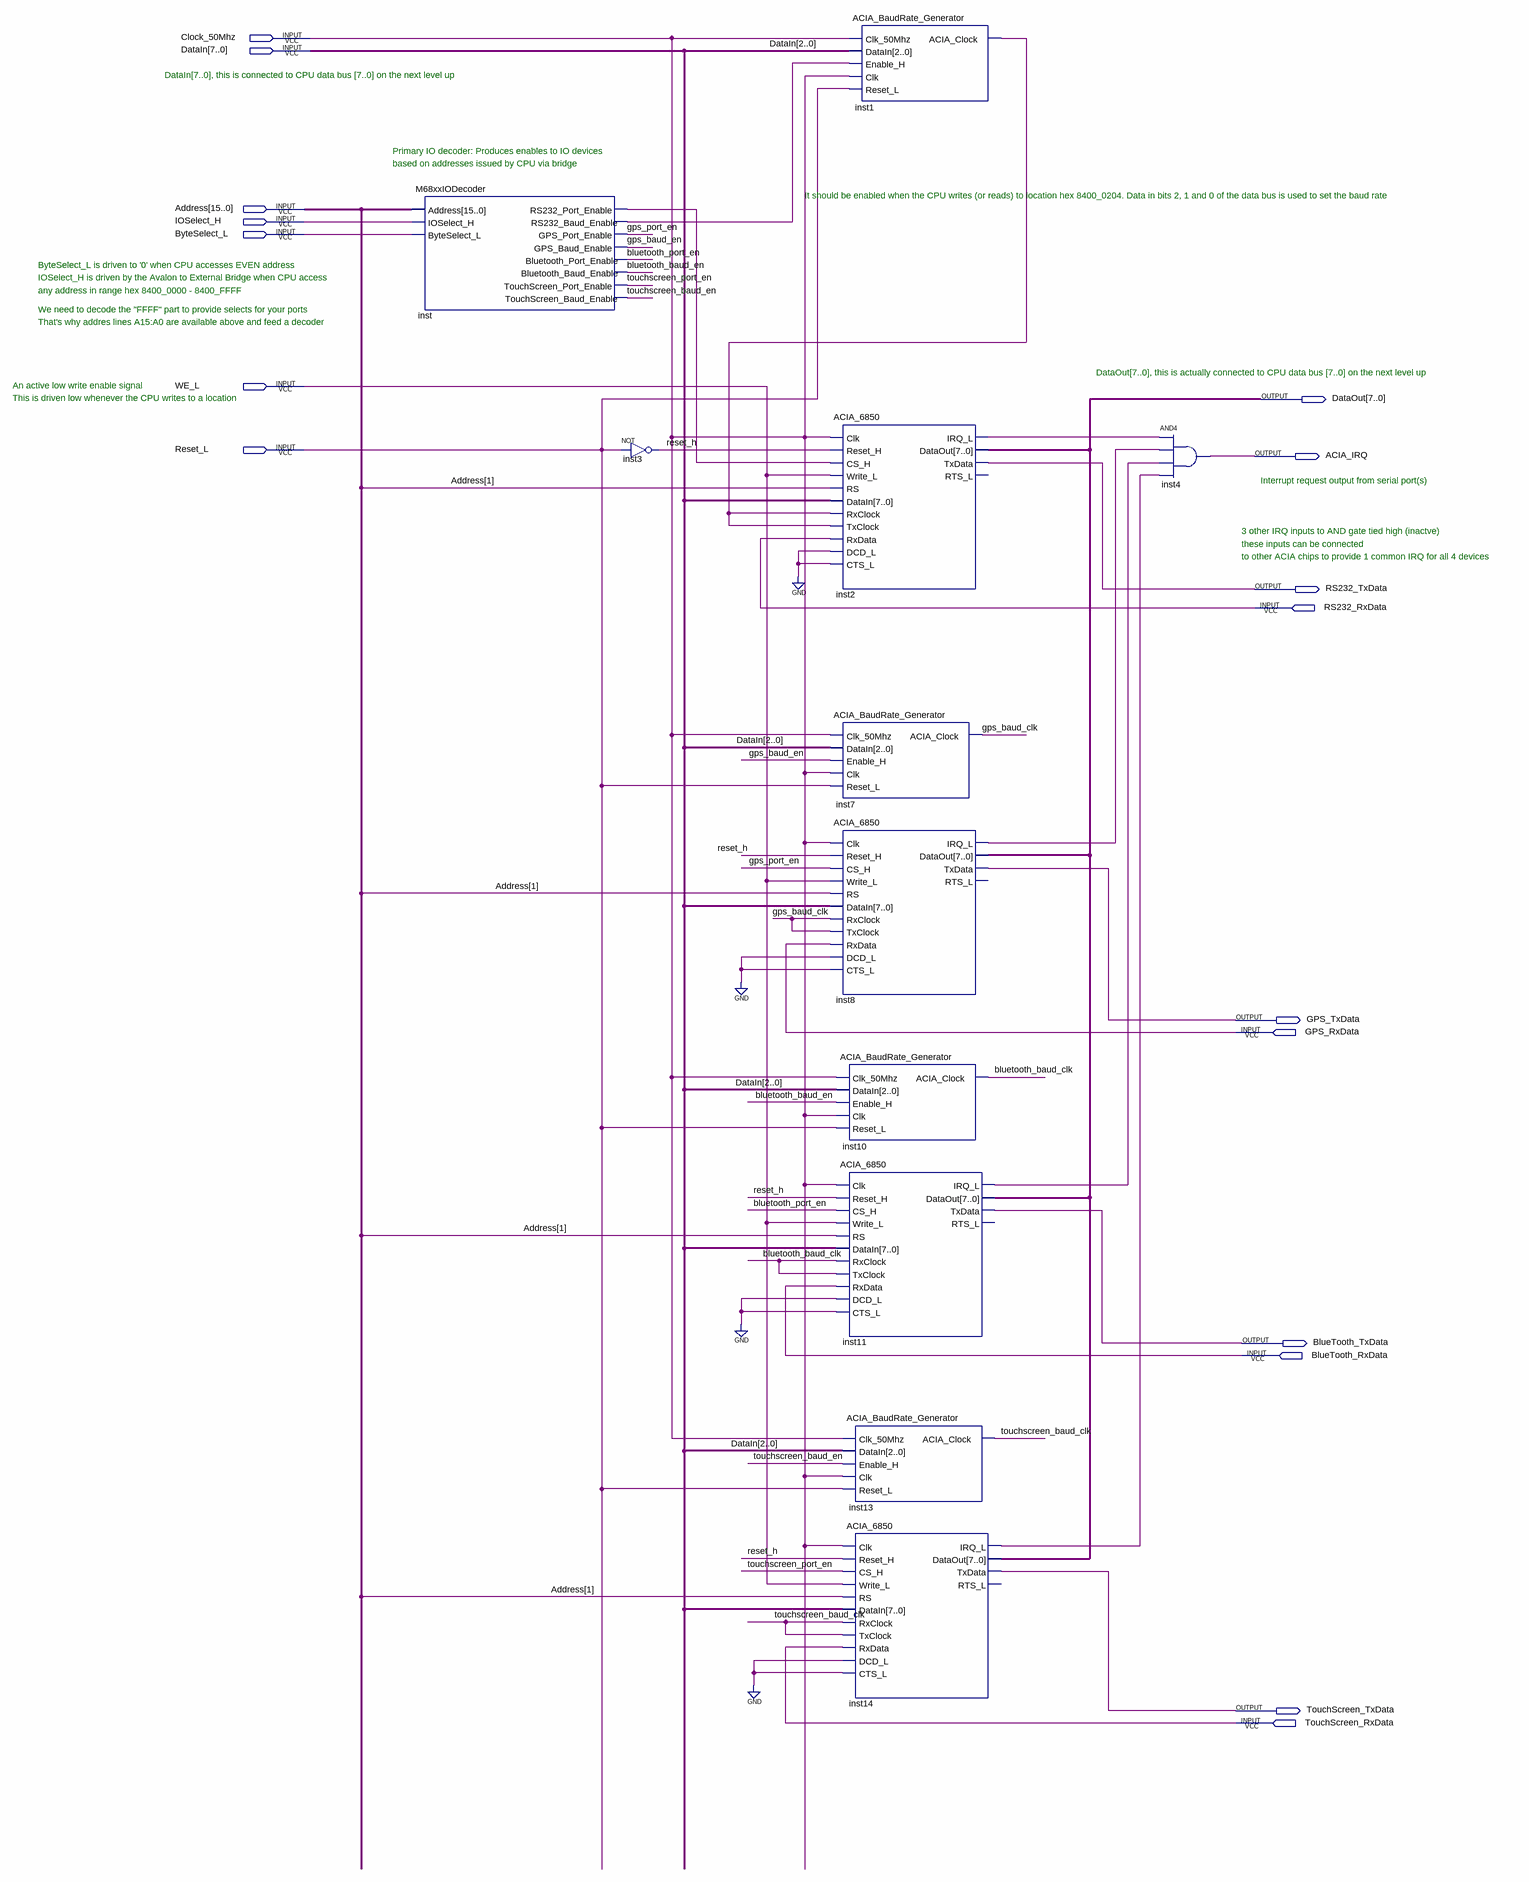
[diagram p0: schematic sheet]
// Quartus schematic OnChipM68xxIO.bdf as structural Verilog: 11 symbols, 17 pins
module OnChipM68xxIO (
  input  Clock_50Mhz,
  input  [7:0] DataIn,
  input  [15:0] Address,
  input  IOSelect_H,
  input  ByteSelect_L,
  input  WE_L,
  input  Reset_L,
  input  RS232_RxData,
  input  GPS_RxData,
  input  BlueTooth_RxData,
  input  TouchScreen_RxData,
  output [7:0] DataOut,
  output ACIA_IRQ,
  output RS232_TxData,
  output GPS_TxData,
  output BlueTooth_TxData,
  output TouchScreen_TxData
);

  wire bluetooth_baud_clk, bluetooth_baud_en, bluetooth_port_en, gps_baud_clk, gps_baud_en, gps_port_en,
       inst1_acia_clock, inst2_irq_l, inst8_irq_l, inst11_irq_l, inst14_irq_l, inst_rs232_baud_enable,
       inst_rs232_port_enable, reset_h, touchscreen_baud_clk, touchscreen_baud_en, touchscreen_port_en;

  M68xxIODecoder inst (
    .Address(Address), .IOSelect_H(IOSelect_H), .ByteSelect_L(ByteSelect_L),
    .RS232_Port_Enable(inst_rs232_port_enable), .RS232_Baud_Enable(inst_rs232_baud_enable),
    .GPS_Port_Enable(gps_port_en), .GPS_Baud_Enable(gps_baud_en), .Bluetooth_Port_Enable(bluetooth_port_en),
    .Bluetooth_Baud_Enable(bluetooth_baud_en), .TouchScreen_Port_Enable(touchscreen_port_en),
    .TouchScreen_Baud_Enable(touchscreen_baud_en));
  not inst3 (reset_h, Reset_L);
  ACIA_6850 inst2 (
    .Clk(Clock_50Mhz), .Reset_H(reset_h), .CS_H(inst_rs232_port_enable), .Write_L(WE_L), .RS(Address[1]),
    .DataIn(DataIn), .RxClock(inst1_acia_clock), .TxClock(inst1_acia_clock), .RxData(RS232_RxData),
    .DCD_L(1'b0), .CTS_L(1'b0), .IRQ_L(inst2_irq_l), .DataOut(DataOut), .TxData(RS232_TxData));  // open: RTS_L
  ACIA_BaudRate_Generator inst7 (
    .Clk_50Mhz(Clock_50Mhz), .DataIn(DataIn[2:0]), .Enable_H(gps_baud_en), .Clk(Clock_50Mhz),
    .Reset_L(Reset_L), .ACIA_Clock(gps_baud_clk));
  ACIA_6850 inst8 (
    .Clk(Clock_50Mhz), .Reset_H(reset_h), .CS_H(gps_port_en), .Write_L(WE_L), .RS(Address[1]),
    .DataIn(DataIn), .RxClock(gps_baud_clk), .TxClock(gps_baud_clk), .RxData(GPS_RxData), .DCD_L(1'b0),
    .CTS_L(1'b0), .IRQ_L(inst8_irq_l), .DataOut(DataOut), .TxData(GPS_TxData));  // open: RTS_L
  ACIA_BaudRate_Generator inst10 (
    .Clk_50Mhz(Clock_50Mhz), .DataIn(DataIn[2:0]), .Enable_H(bluetooth_baud_en), .Clk(Clock_50Mhz),
    .Reset_L(Reset_L), .ACIA_Clock(bluetooth_baud_clk));
  ACIA_6850 inst11 (
    .Clk(Clock_50Mhz), .Reset_H(reset_h), .CS_H(bluetooth_port_en), .Write_L(WE_L), .RS(Address[1]),
    .DataIn(DataIn), .RxClock(bluetooth_baud_clk), .TxClock(bluetooth_baud_clk), .RxData(BlueTooth_RxData),
    .DCD_L(1'b0), .CTS_L(1'b0), .IRQ_L(inst11_irq_l), .DataOut(DataOut), .TxData(BlueTooth_TxData));  // open: RTS_L
  ACIA_BaudRate_Generator inst13 (
    .Clk_50Mhz(Clock_50Mhz), .DataIn(DataIn[2:0]), .Enable_H(touchscreen_baud_en), .Clk(Clock_50Mhz),
    .Reset_L(Reset_L), .ACIA_Clock(touchscreen_baud_clk));
  ACIA_6850 inst14 (
    .Clk(Clock_50Mhz), .Reset_H(reset_h), .CS_H(touchscreen_port_en), .Write_L(WE_L), .RS(Address[1]),
    .DataIn(DataIn), .RxClock(touchscreen_baud_clk), .TxClock(touchscreen_baud_clk),
    .RxData(TouchScreen_RxData), .DCD_L(1'b0), .CTS_L(1'b0), .IRQ_L(inst14_irq_l), .DataOut(DataOut),
    .TxData(TouchScreen_TxData));  // open: RTS_L
  ACIA_BaudRate_Generator inst1 (
    .Clk_50Mhz(Clock_50Mhz), .DataIn(DataIn[2:0]), .Enable_H(inst_rs232_baud_enable), .Clk(Clock_50Mhz),
    .Reset_L(Reset_L), .ACIA_Clock(inst1_acia_clock));
  and inst4 (ACIA_IRQ, inst2_irq_l, inst8_irq_l, inst11_irq_l, inst14_irq_l);

  // Notes on the sheet:
  //   DataIn[7..0], this is connected to CPU data bus [7..0] on the next level up
  //   Primary IO decoder: Produces enables to IO devices
  //   based on addresses issued by CPU via bridge
  //   It should be enabled when the CPU writes (or reads) to location hex 8400_0204. Data in bits 2, 1 and 0 of the data bus is used to set the baud rate
  //   ByteSelect_L is driven to '0' when CPU accesses EVEN address
  //   IOSelect_H is driven by the Avalon to External Bridge when CPU access
  //   any address in range hex 8400_0000 - 8400_FFFF
  //   We need to decode the "FFFF" part to provide selects for your ports 
  //   That's why addres lines A15:A0 are available above and feed a decoder
  //   DataOut[7..0], this is actually connected to CPU data bus [7..0] on the next level up
  //   An active low write enable signal
  //   This is driven low whenever the CPU writes to a location
  //   Interrupt request output from serial port(s)
  //   3 other IRQ inputs to AND gate tied high (inactve)
  //   these inputs can be connected
  //   to other ACIA chips to provide 1 common IRQ for all 4 devices
endmodule
